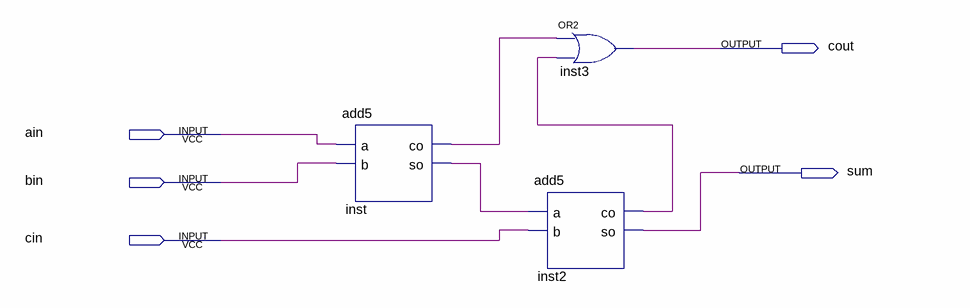
[diagram p0: schematic sheet]
// Quartus schematic add6.bdf as structural Verilog: 3 symbols, 5 pins
module add6 (
  input  ain,
  input  bin,
  input  cin,
  output cout,
  output sum
);

  wire inst2_co, inst_co, inst_so;

  add5 inst (.a(ain), .b(bin), .co(inst_co), .so(inst_so));
  or inst3 (cout, inst_co, inst2_co);
  add5 inst2 (.a(inst_so), .b(cin), .co(inst2_co), .so(sum));
endmodule
